# Altium project DriverPCB.PrjPcb
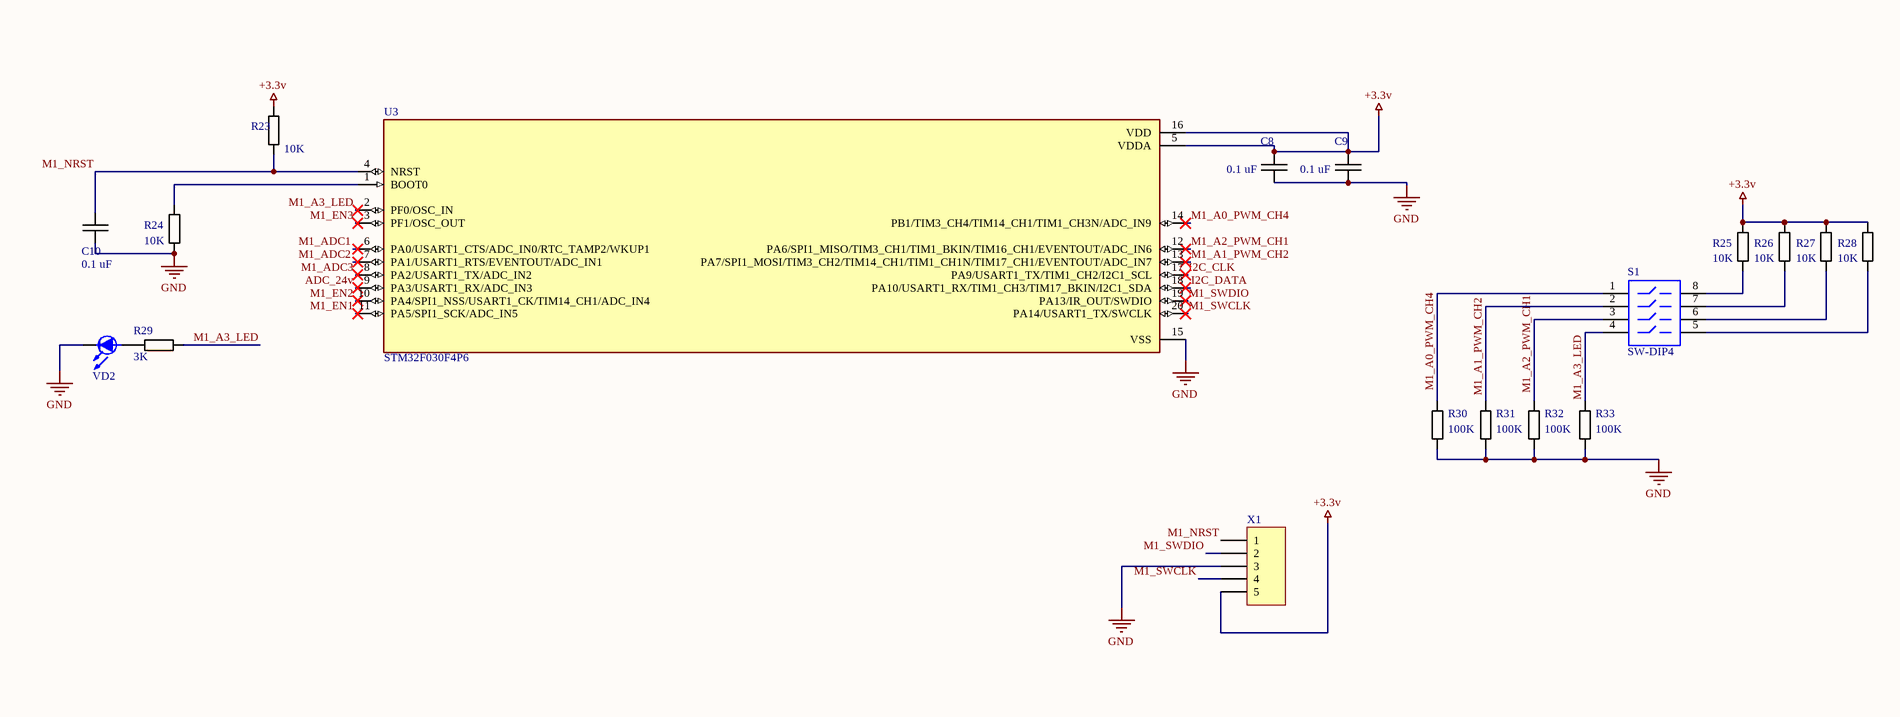
[diagram p0: DriverPCB.SchDoc, top left]
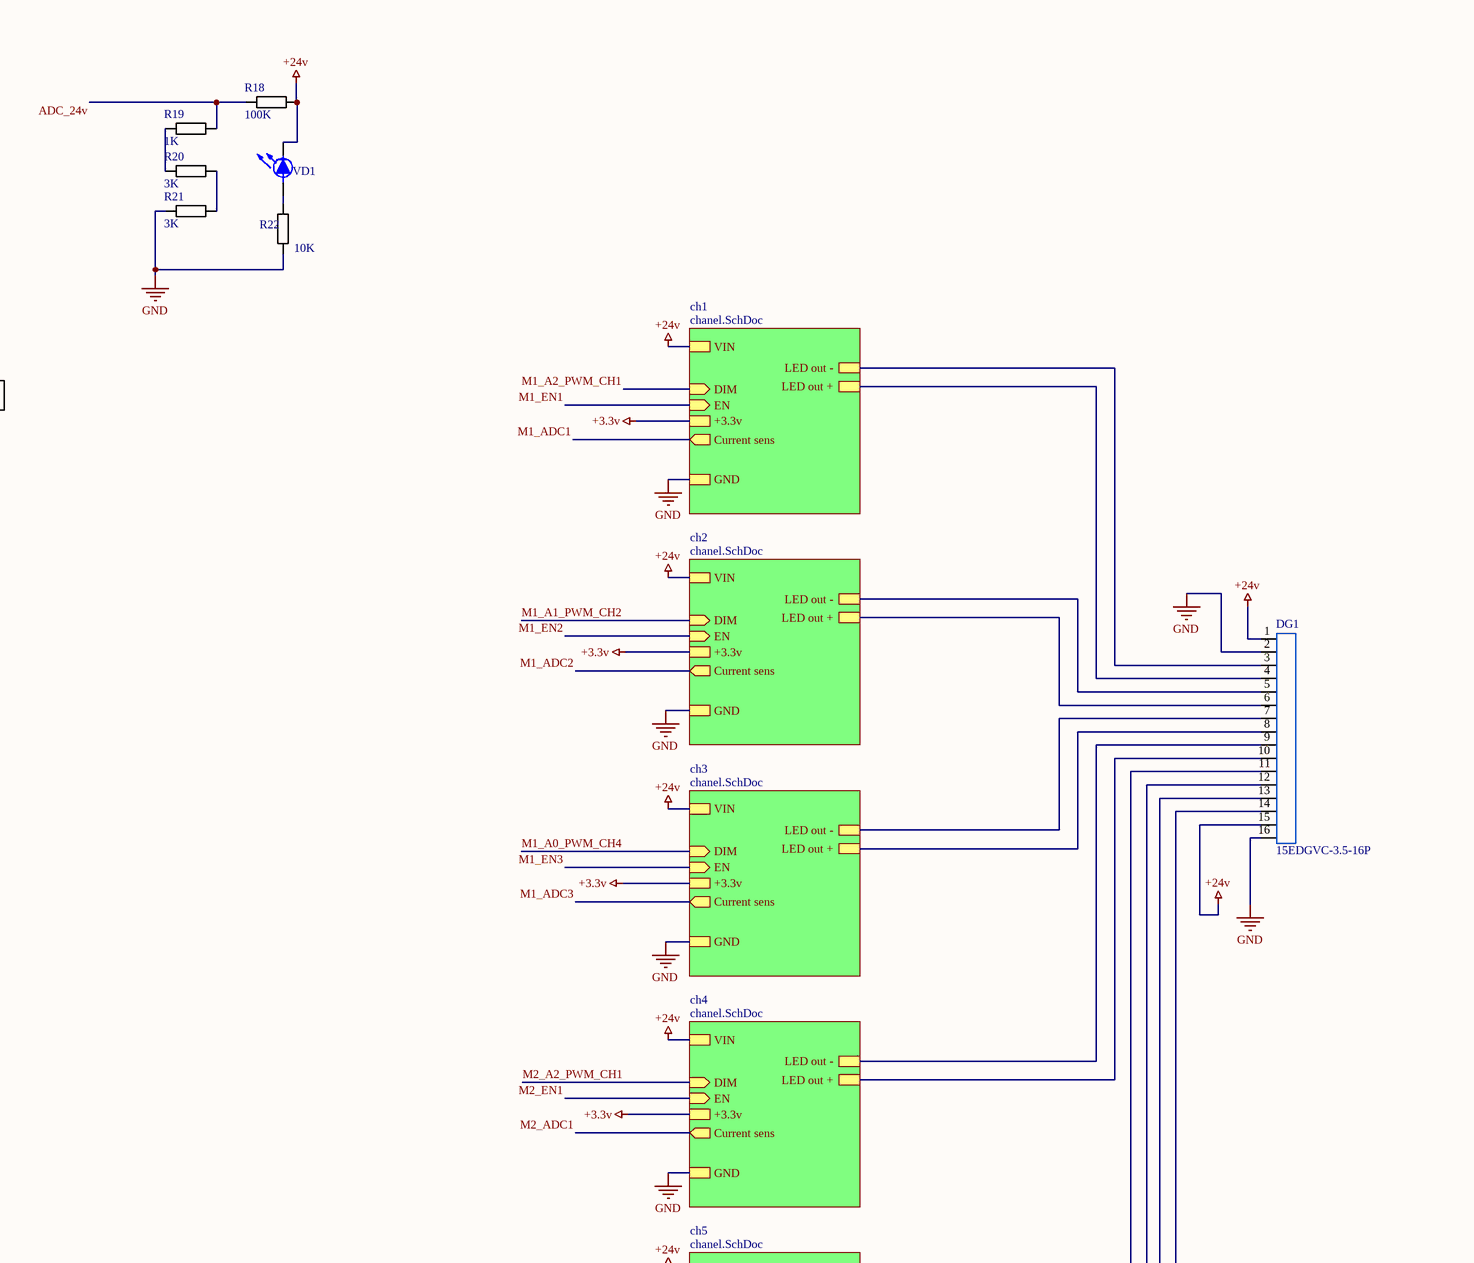
[diagram p1: DriverPCB.SchDoc, top right]
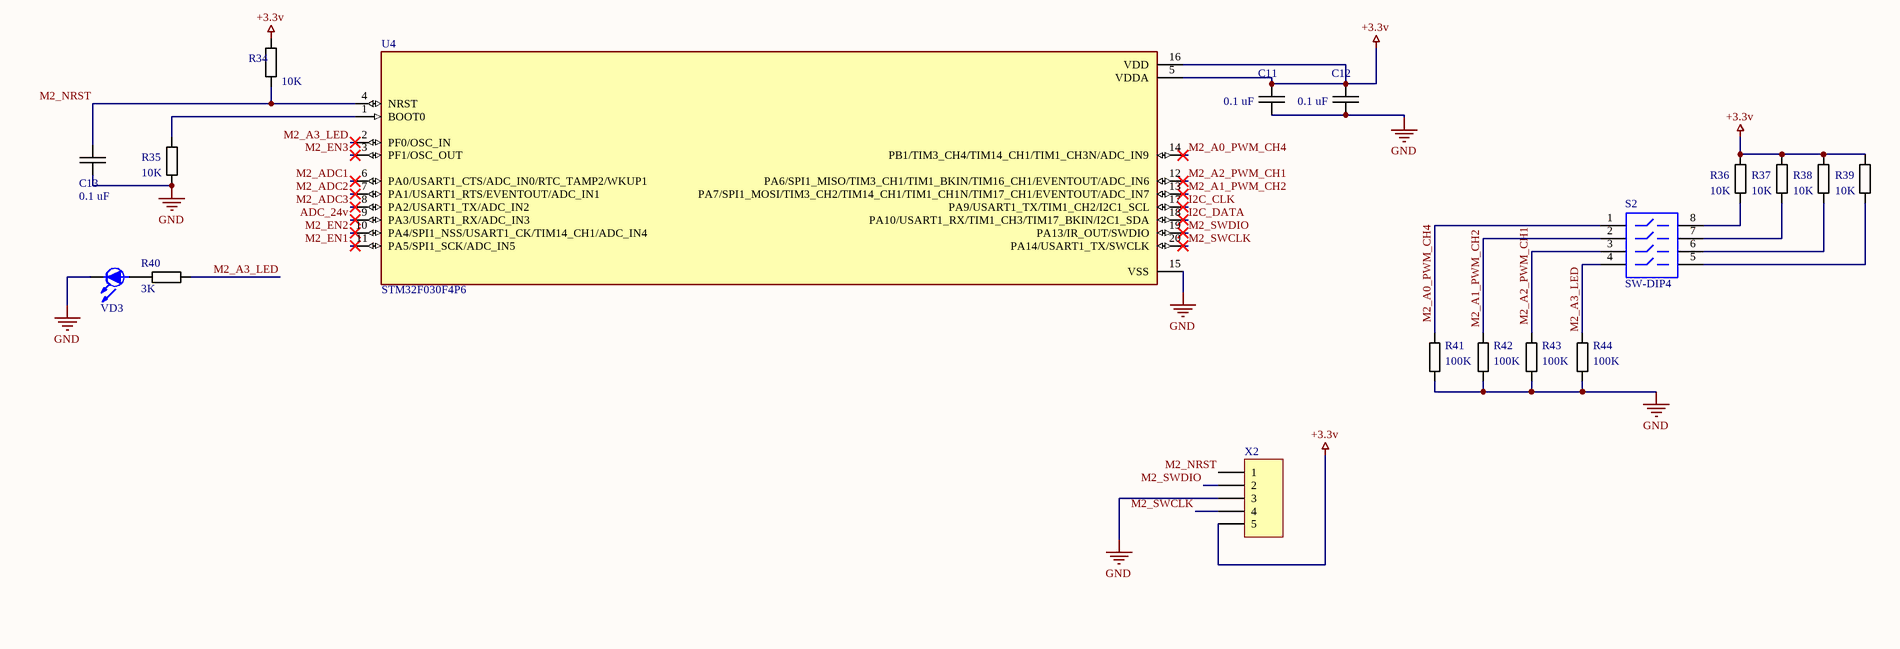
[diagram p2: DriverPCB.SchDoc, bottom left]
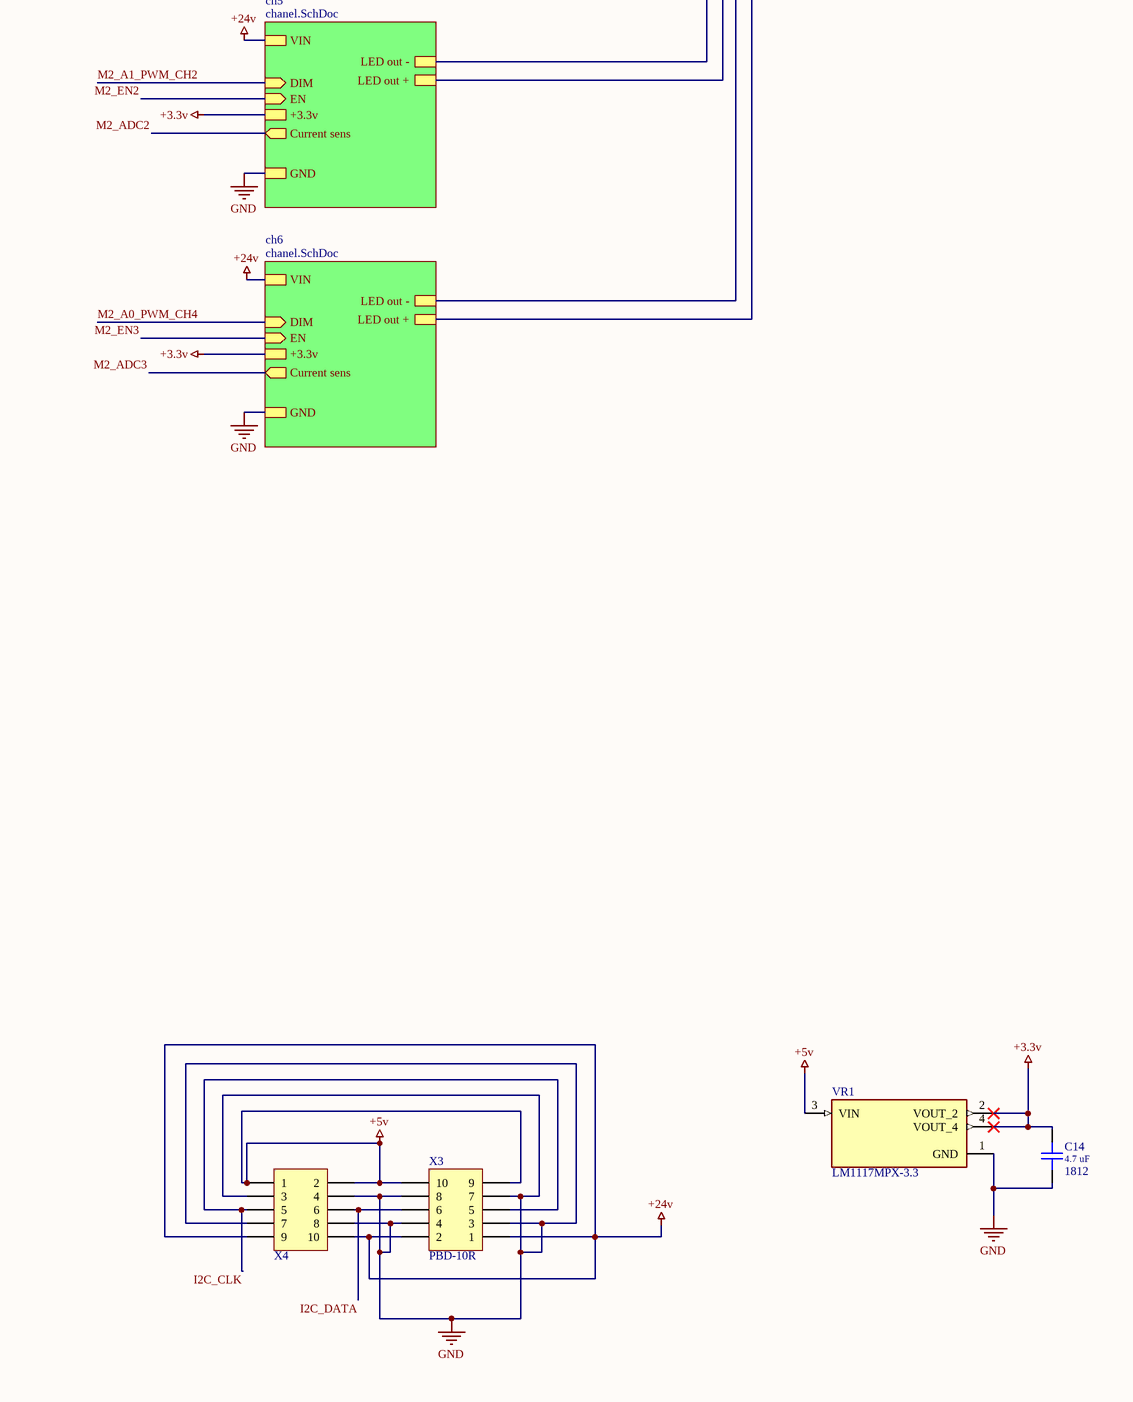
[diagram p3: DriverPCB.SchDoc, bottom right]
2 sheets, 233 parts. Net scope: hierarchical (ports join the sheet entries above them; power ports are global).
Board file: DriverPCB.PcbDoc
Sheets:
  DriverPCB.SchDoc
    ch1 = chanel.SchDoc
    ch2 = chanel.SchDoc
    ch3 = chanel.SchDoc
    ch4 = chanel.SchDoc
    ch5 = chanel.SchDoc
    ch6 = chanel.SchDoc

## Sheet DriverPCB.SchDoc
size A1

### Parts
C8  0.1 uF  [CAPACITOR 0603]
C9  0.1 uF  [CAPACITOR 0603]
C10  0.1 uF  [CAPACITOR 0603]
C11  0.1 uF  [CAPACITOR 0603]
C12  0.1 uF  [CAPACITOR 0603]
C13  0.1 uF  [CAPACITOR 0603]
C14  value 4.7 uF  Package: 1812  [CAPCHIP1812]  (hidden comment: Cap C)
DG1  15EDGVC-3.5-16P  [15EDGVC-3.5-16P]
R18  100K  [Resistor 0402]
R19  1K  [Resistor 0402]
R20  3K  [Resistor 0402]
R21  3K  [Resistor 0402]
R22  10K  [Resistor 0402]
R23  10K  [Resistor 0402]
R24  10K  [Resistor 0402]
R25  10K  [Resistor 0402]
R26  10K  [Resistor 0402]
R27  10K  [Resistor 0402]
R28  10K  [Resistor 0402]
R29  3K  [Resistor 0402]
R30  100K  [Resistor 0402]
R31  100K  [Resistor 0402]
R32  100K  [Resistor 0402]
R33  100K  [Resistor 0402]
R34  10K  [Resistor 0402]
R35  10K  [Resistor 0402]
R36  10K  [Resistor 0402]
R37  10K  [Resistor 0402]
R38  10K  [Resistor 0402]
R39  10K  [Resistor 0402]
R40  3K  [Resistor 0402]
R41  100K  [Resistor 0402]
R42  100K  [Resistor 0402]
R43  100K  [Resistor 0402]
R44  100K  [Resistor 0402]
S1  SW-DIP4  [DIP-8]
S2  SW-DIP4  [DIP-8]
U3  STM32F030F4P6  [SOP65P640X120-20N]
U4  STM32F030F4P6  [SOP65P640X120-20N]
VD1  one color  [0805-]  (value not drawn)
VD2  (no value)  [0805-]
VD3  (no value)  [0805-]
VR1  LM1117MPX-3.3  [VREG_LM1117MPX-3.3]
X1  (no value)  [PLS-5-3D]
X2  (no value)  [PLS-5-3D]
X3  PBD-10R  [PBD-10RR]
X4  PLD-10R  [PLD-10RR1]  (value not drawn)

### Sub-sheets
ch1 = chanel.SchDoc: VIN, GND, LED out +, LED out -, DIM (in), EN (in), +3.3v, Current sens (out)
ch2 = chanel.SchDoc: VIN, GND, LED out +, LED out -, DIM (in), EN (in), +3.3v, Current sens (out)
ch3 = chanel.SchDoc: VIN, GND, LED out +, LED out -, DIM (in), EN (in), +3.3v, Current sens (out)
ch4 = chanel.SchDoc: VIN, GND, LED out +, LED out -, DIM (in), EN (in), +3.3v, Current sens (out)
ch5 = chanel.SchDoc: VIN, GND, LED out +, LED out -, DIM (in), EN (in), +3.3v, Current sens (out)
ch6 = chanel.SchDoc: VIN, GND, LED out +, LED out -, DIM (in), EN (in), +3.3v, Current sens (out)

### Nets
+3.3v: C8.1 C9.1 C11.1 C12.1 C14.2 R23.2 R25.1 R26.1 R27.1 R28.1 R34.2 R36.1 R37.1 R38.1 R39.1 U3.5(VDDA) U3.16(VDD) U4.5(VDDA) U4.16(VDD) VR1.2(VOUT_2) VR1.4(VOUT_4) X1.5 X2.5 ; sheet ch1/+3.3v, sheet ch2/+3.3v, sheet ch3/+3.3v, sheet ch4/+3.3v, sheet ch5/+3.3v, sheet ch6/+3.3v
+5v: VR1.3(VIN) X3.9 X3.10 X4.1 X4.2
+24v: DG1.1 DG1.15 R18.1 VD1.K(k) X3.1 X3.2 X4.9 X4.10 ; sheet ch1/VIN, sheet ch2/VIN, sheet ch3/VIN, sheet ch4/VIN, sheet ch5/VIN, sheet ch6/VIN
GND: C8.2 C9.2 C10.1 C11.2 C12.2 C13.1 C14.1 DG1.2 DG1.16 R21.1 R22.1 R24.2 R30.2 R31.2 R32.2 R33.2 R35.2 R41.2 R42.2 R43.2 R44.2 U3.15(VSS) U4.15(VSS) VD2.K(k) VD3.K(k) VR1.1(GND) X1.3 X2.3 X3.3 X3.4 X3.7 X3.8 X4.3 X4.4 X4.7 X4.8 ; sheet ch1/GND, sheet ch2/GND, sheet ch3/GND, sheet ch4/GND, sheet ch5/GND, sheet ch6/GND
ADC_24v: R18.2 R19.2 U3.9(PA3/USART1_RX/ADC_IN3) U4.9(PA3/USART1_RX/ADC_IN3)
I2C_CLK: U3.17(PA9/USART1_TX/TIM1_CH2/I2C1_SCL) U4.17(PA9/USART1_TX/TIM1_CH2/I2C1_SCL) X3.5 X4.5
I2C_DATA: U3.18(PA10/USART1_RX/TIM1_CH3/TIM17_BKIN/I2C1_SDA) U4.18(PA10/USART1_RX/TIM1_CH3/TIM17_BKIN/I2C1_SDA) X3.6 X4.6
M1_A0_PWM_CH4: R30.1 S1.1 U3.14(PB1/TIM3_CH4/TIM14_CH1/TIM1_CH3N/ADC_IN9) ; sheet ch3/DIM
M1_A1_PWM_CH2: R31.1 S1.2 U3.13(PA7/SPI1_MOSI/TIM3_CH2/TIM14_CH1/TIM1_CH1N/TIM17_CH1/EVENTOUT/ADC_IN7) ; sheet ch2/DIM
M1_A2_PWM_CH1: R32.1 S1.3 U3.12(PA6/SPI1_MISO/TIM3_CH1/TIM1_BKIN/TIM16_CH1/EVENTOUT/ADC_IN6) ; sheet ch1/DIM
M1_A3_LED: R29.1 R33.1 S1.4 U3.2(PF0/OSC_IN)
M1_ADC1: U3.6(PA0/USART1_CTS/ADC_IN0/RTC_TAMP2/WKUP1) ; sheet ch1/Current sens
M1_ADC2: U3.7(PA1/USART1_RTS/EVENTOUT/ADC_IN1) ; sheet ch2/Current sens
M1_ADC3: U3.8(PA2/USART1_TX/ADC_IN2) ; sheet ch3/Current sens
M1_EN1: U3.11(PA5/SPI1_SCK/ADC_IN5) ; sheet ch1/EN
M1_EN2: U3.10(PA4/SPI1_NSS/USART1_CK/TIM14_CH1/ADC_IN4) ; sheet ch2/EN
M1_EN3: U3.3(PF1/OSC_OUT) ; sheet ch3/EN
M1_NRST: C10.2 R23.1 U3.4(NRST) X1.1
M1_SWCLK: U3.20(PA14/USART1_TX/SWCLK) X1.4
M1_SWDIO: U3.19(PA13/IR_OUT/SWDIO) X1.2
M2_A0_PWM_CH4: R41.1 S2.1 U4.14(PB1/TIM3_CH4/TIM14_CH1/TIM1_CH3N/ADC_IN9) ; sheet ch6/DIM
M2_A1_PWM_CH2: R42.1 S2.2 U4.13(PA7/SPI1_MOSI/TIM3_CH2/TIM14_CH1/TIM1_CH1N/TIM17_CH1/EVENTOUT/ADC_IN7) ; sheet ch5/DIM
M2_A2_PWM_CH1: R43.1 S2.3 U4.12(PA6/SPI1_MISO/TIM3_CH1/TIM1_BKIN/TIM16_CH1/EVENTOUT/ADC_IN6) ; sheet ch4/DIM
M2_A3_LED: R40.1 R44.1 S2.4 U4.2(PF0/OSC_IN)
M2_ADC1: U4.6(PA0/USART1_CTS/ADC_IN0/RTC_TAMP2/WKUP1) ; sheet ch4/Current sens
M2_ADC2: U4.7(PA1/USART1_RTS/EVENTOUT/ADC_IN1) ; sheet ch5/Current sens
M2_ADC3: U4.8(PA2/USART1_TX/ADC_IN2) ; sheet ch6/Current sens
M2_EN1: U4.11(PA5/SPI1_SCK/ADC_IN5) ; sheet ch4/EN
M2_EN2: U4.10(PA4/SPI1_NSS/USART1_CK/TIM14_CH1/ADC_IN4) ; sheet ch5/EN
M2_EN3: U4.3(PF1/OSC_OUT) ; sheet ch6/EN
M2_NRST: C13.2 R34.1 U4.4(NRST) X2.1
M2_SWCLK: U4.20(PA14/USART1_TX/SWCLK) X2.4
M2_SWDIO: U4.19(PA13/IR_OUT/SWDIO) X2.2
NetC5_ch1_1: DG1.3 ; sheet ch1/LED out -
NetC5_ch1_2: DG1.4 ; sheet ch1/LED out +
NetC5_ch2_1: DG1.5 ; sheet ch2/LED out -
NetC5_ch2_2: DG1.6 ; sheet ch2/LED out +
NetC5_ch3_1: DG1.7 ; sheet ch3/LED out -
NetC5_ch3_2: DG1.8 ; sheet ch3/LED out +
NetC5_ch4_1: DG1.9 ; sheet ch4/LED out -
NetC5_ch4_2: DG1.10 ; sheet ch4/LED out +
NetC5_ch5_1: DG1.11 ; sheet ch5/LED out -
NetC5_ch5_2: DG1.12 ; sheet ch5/LED out +
NetC5_ch6_1: DG1.13 ; sheet ch6/LED out -
NetC5_ch6_2: DG1.14 ; sheet ch6/LED out +
NetR19_1: R19.1 R20.1
NetR20_2: R20.2 R21.2
NetR22_2: R22.2 VD1.A(a)
NetR24_1: R24.1 U3.1(BOOT0)
NetR25_2: R25.2 S1.8
NetR26_2: R26.2 S1.7
NetR27_2: R27.2 S1.6
NetR28_2: R28.2 S1.5
NetR29_2: R29.2 VD2.A(a)
NetR35_1: R35.1 U4.1(BOOT0)
NetR36_2: R36.2 S2.8
NetR37_2: R37.2 S2.7
NetR38_2: R38.2 S2.6
NetR39_2: R39.2 S2.5
NetR40_2: R40.2 VD3.A(a)

### Library data of the parts
C8-C13 = Capasitor: Value: 0.1 uF; Package: 0603
C14 = Cap C: Ceramic Capacitor; Class: Электронные компоненты; SubClass: Конденсаторы; TKE: {TKE}; Ordering_Information: {Ordering_Information}; Installation: {Installation}; Body: {Body}; Nominal_voltage_V: {Nominal_voltage_V}; Tolerance_Percent: {Tolerance_Percent}; Pins: {Pins}
R18-R44 = Resistor: Package: 0402
  R18 R30-R33 R41-R44: Value: 100K
  R19: Value: 1K
  R20 R21 R29 R40: Value: 3K
  R22-R28 R34-R39: Value: 10K
S1 S2 = SW-DIP4: DIP Switch; Published: 24-Mar-1999; LatestRevisionDate: 17-Jul-2002; LatestRevisionNote: Re-released for DXP Platform.; PackageReference: DIP-8; Publisher: Altium Limited
U3 U4 = STM32F030F4P6: MCU 32-bit STM32F ARM Cortex M0 RISC 16KB Flash 2.5V/3.3V 20-Pin TSSOP Tray; Value: *; Availability: Unavailable; Price: None; MP: STM32F030F4P6; Package: None
VD1 = LED SMD: Class: Электронные компоненты; SubClass: Светодиоды; Value: {Value}; Pitch_mm: {Pitch_mm}; Ordering_Information: {Ordering_Information}; Luminous_intensity_mcd: {Luminous_intensity_mcd}; Diameter_mm: {Diameter_mm}; Color: {Color}; Installation: {Installation}; Body: {Body}; Pins: 2
VD2 VD3 = LED SMD: Value: 0805; CompType: LED; Note: Read; Pins: 2; Package: 0805
VR1 = LM1117MPX-3.3: 800-mA 15-V linear voltage regulator; MF: Texas Instruments; Check_prices: https://www.snapeda.com/parts/LM1117MPX-3.3/Texas+Instruments/view-part/?ref=eda; Value: *; Availability: In Stock; MP: LM1117MPX-3.3; Price: None; Package: SOT-223-4 Texas Instruments; SnapEDA_Link: https://www.snapeda.com/parts/LM1117MPX-3.3/Texas+Instruments/view-part/?ref=snap; Purchase-URL: https://pricing.snapeda.com/search/part/LM1117MPX-3.3/?ref=eda
X1 X2 = PLS-5: Header, 5-Pin; CompType: connector; Note: header pins 2.54mm x 5; Package: 2.54 x 5; PartNumber: PLS-5; Pins: 5
X3 = PBD-10R: Header, 5-Pin, Dual row
X4 = PLD-10R: Header, 5-Pin, Dual row

## Sheet chanel.SchDoc
size A2
Used 6 times, as channels ch1, ch2, ch3, ch4, ch5, ch6. Parts and nets are listed once, with the designators drawn on the sheet.
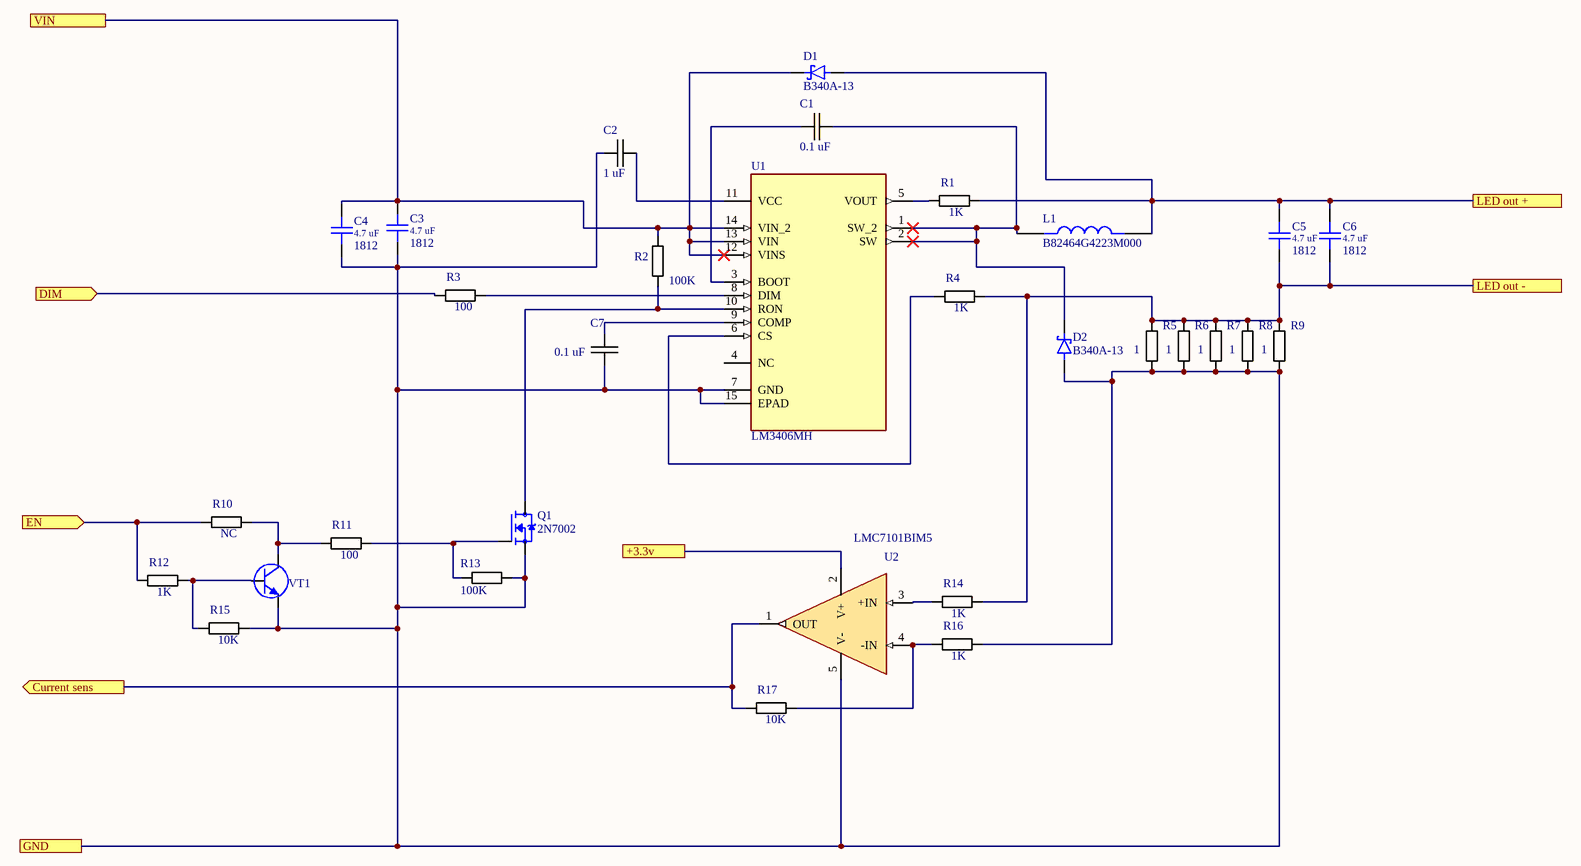
[diagram p4: chanel.SchDoc]

### Parts
C1  0.1 uF  [CAPACITOR 0603]
C2  1 uF  [CAPACITOR 0603]
C3  value 4.7 uF  Package: 1812  [CAPCHIP1812]  (hidden comment: Cap C)
C4  value 4.7 uF  Package: 1812  [CAPCHIP1812]  (hidden comment: Cap C)
C5  value 4.7 uF  Package: 1812  [CAPCHIP1812]  (hidden comment: Cap C)
C6  value 4.7 uF  Package: 1812  [CAPCHIP1812]  (hidden comment: Cap C)
C7  0.1 uF  [CAPACITOR 0603]
D1  B340A-13  [DIOM5226X240N]
D2  B340A-13  [DIOM5226X240N]
L1  B82464G4223M000  [IND_B82464G4223M000]
Q1  2N7002  [SOT95P240X111-3N]
R1  1K  [Resistor 0402]
R2  100K  [Resistor 0402]
R3  100  [Resistor 0402]
R4  1K  [Resistor 0402]
R5  1  [Resistor 1206]
R6  1  [Resistor 1206]
R7  1  [Resistor 1206]
R8  1  [Resistor 1206]
R9  1  [Resistor 1206]
R10  NC  [Resistor 0402]
R11  100  [Resistor 0402]
R12  1K  [Resistor 0402]
R13  100K  [Resistor 0402]
R14  1K  [Resistor 0402]
R15  10K  [Resistor 0402]
R16  1K  [Resistor 0402]
R17  10K  [Resistor 0402]
U1  LM3406MH  [SOP65P640X110-15N]
U2  LMC7101BIM5  [*SOT95P280X145-5N]
VT1  NPN BEC  [SOT23]  (value not drawn)

### Ports
+3.3v, Current sens (out), DIM (in), EN (in), GND, LED out +, LED out -, VIN

### Nets
+3.3v: U2.2(V+) ; port +3.3v
Current sens: R17.2 U2.1(OUT) ; port Current sens
DIM: R3.2 ; port DIM
EN: R10.2 R12.2 ; port EN
GND: C2.2 C3.1 C4.1 C7.2 D2.A Q1.2(S) R5.2 R6.2 R7.2 R8.2 R9.2 R13.1 R15.1 R16.1 U1.7(GND) U1.15(EPAD) U2.5(V-) VT1.2(E) ; port GND
LED out +: C5.2 C6.2 D1.A L1.2 R1.1 ; port LED out +
LED out -: C5.1 C6.1 R4.1 R5.1 R6.1 R7.1 R8.1 R9.1 R14.1 ; port LED out -
VIN: C3.2 C4.2 D1.C R2.2 U1.12(VINS) U1.13(VIN) U1.14(VIN_2) ; port VIN
NetC1_1: C1.1 D2.C L1.1 U1.1(SW_2) U1.2(SW)
NetC1_2: C1.2 U1.3(BOOT)
NetC2_1: C2.1 U1.11(VCC)
NetC7_1: C7.1 U1.9(COMP)
NetQ1_1: Q1.1(G) R11.1 R13.2
NetQ1_3: Q1.3(D) R2.1 U1.10(RON)
NetR1_2: R1.2 U1.5(VOUT)
NetR3_1: R3.1 U1.8(DIM)
NetR4_2: R4.2 U1.6(CS)
NetR10_1: R10.1 R11.2 VT1.3(C)
NetR12_1: R12.1 R15.2 VT1.1(B)
NetR14_2: R14.2 U2.3(+IN)
NetR16_2: R16.2 R17.1 U2.4(-IN)

Not connected (* = marked no-connect by the designer): U1 4(NC)

### Channels
ch1: designators end in _ch1; ports +3.3v=+3.3v Current sens=M1_ADC1 DIM=M1_A2_PWM_CH1 EN=M1_EN1 GND=GND LED out +=NetC5_ch1_2 LED out -=NetC5_ch1_1 VIN=+24v
ch2: designators end in _ch2; ports +3.3v=+3.3v Current sens=M1_ADC2 DIM=M1_A1_PWM_CH2 EN=M1_EN2 GND=GND LED out +=NetC5_ch2_2 LED out -=NetC5_ch2_1 VIN=+24v
ch3: designators end in _ch3; ports +3.3v=+3.3v Current sens=M1_ADC3 DIM=M1_A0_PWM_CH4 EN=M1_EN3 GND=GND LED out +=NetC5_ch3_2 LED out -=NetC5_ch3_1 VIN=+24v
ch4: designators end in _ch4; ports +3.3v=+3.3v Current sens=M2_ADC1 DIM=M2_A2_PWM_CH1 EN=M2_EN1 GND=GND LED out +=NetC5_ch4_2 LED out -=NetC5_ch4_1 VIN=+24v
ch5: designators end in _ch5; ports +3.3v=+3.3v Current sens=M2_ADC2 DIM=M2_A1_PWM_CH2 EN=M2_EN2 GND=GND LED out +=NetC5_ch5_2 LED out -=NetC5_ch5_1 VIN=+24v
ch6: designators end in _ch6; ports +3.3v=+3.3v Current sens=M2_ADC3 DIM=M2_A0_PWM_CH4 EN=M2_EN3 GND=GND LED out +=NetC5_ch6_2 LED out -=NetC5_ch6_1 VIN=+24v

### Library data of the parts
C1 C2 C7 = Capasitor: Package: 0603
  C1 C7: Value: 0.1 uF
  C2: Value: 1 uF
C3-C6 = Cap C: as C14 on sheet DriverPCB; Pins: {Pins}
D1 D2 = B340A-13: Diode Schottky 40 V 3A Surface Mount SMA; MF: Diodes Inc.; Value: *; MP: B340A-13; Package: DO-214 Diodes Inc.; Availability: In Stock; Price: None; SnapEDA_Link: https://www.snapeda.com/parts/B340A-13/Diodes+Inc./view-part/?ref=snap; Check_prices: https://www.snapeda.com/parts/B340A-13/Diodes+Inc./view-part/?ref=eda; Purchase-URL: https://pricing.snapeda.com/search/part/B340A-13/?ref=eda
L1 = B82464G4223M000: MF: TDK ELECTRONICS; Check_prices: https://www.snapeda.com/parts/B82464G4223M000/TM+Electronics/view-part/?ref=eda; Package: None; Value: *; MP: B82464G4223M000; SnapEDA_Link: https://www.snapeda.com/parts/B82464G4223M000/TM+Electronics/view-part/?ref=snap; Purchase-URL: https://pricing.snapeda.com/search/part/B82464G4223M000/?ref=eda
Q1 = 2N7002: N-Channel 60V 280mA (Ta) 350mW (Ta) Surface Mount SOT-23-3 (TO-236); MP: altium_native_batch; Package: None; Price: None; Availability: Unavailable; Value: *
R1-R17 = Resistor
  R1 R4 R12 R14 R16: Value: 1K; Package: 0402
  R2 R13: Value: 100K; Package: 0402
  R3 R11: Value: 100; Package: 0402
  R5-R9: Value: 1; Package: 1206
  R10: Value: NC; Package: 0402
  R15 R17: Value: 10K; Package: 0402
U1 = LM3406MH: Constant Current Buck Regulator; Package: None; Price: None; Value: *; MP: LM3406MH; Availability: Unavailable
VT1 = BC846: NPN Bipolar Transistor; Published: 17.04.2012; Publisher: Reukov A.V.
U2 = LMC7101BIM5: Check_prices: https://www.snapeda.com/parts/LMC7101BIM5/Texas%20Instruments/view-part/19255/?ref=eda; SnapEDA_Link: https://www.snapeda.com/parts/LMC7101BIM5/Texas%20Instruments/view-part/19255/?ref=snap; Value: *

## Nets that join several sheets
+3.3v: DriverPCB (23 pins), ch1 (U2_ch1.2), ch2 (U2_ch2.2), ch3 (U2_ch3.2), ch4 (U2_ch4.2), ch5 (U2_ch5.2), ch6 (U2_ch6.2)
+24v: DriverPCB (8 pins), ch1 (7 pins), ch2 (7 pins), ch3 (7 pins), ch4 (7 pins), ch5 (7 pins), ch6 (7 pins)
GND: DriverPCB (36 pins), ch1 (18 pins), ch2 (18 pins), ch3 (18 pins), ch4 (18 pins), ch5 (18 pins), ch6 (18 pins)
M1_A0_PWM_CH4: DriverPCB (R30.1 S1.1 U3.14), ch3 (R3_ch3.2)
M1_A1_PWM_CH2: DriverPCB (R31.1 S1.2 U3.13), ch2 (R3_ch2.2)
M1_A2_PWM_CH1: DriverPCB (R32.1 S1.3 U3.12), ch1 (R3_ch1.2)
M1_ADC1: DriverPCB (U3.6), ch1 (R17_ch1.2 U2_ch1.1)
M1_ADC2: DriverPCB (U3.7), ch2 (R17_ch2.2 U2_ch2.1)
M1_ADC3: DriverPCB (U3.8), ch3 (R17_ch3.2 U2_ch3.1)
M1_EN1: DriverPCB (U3.11), ch1 (R10_ch1.2 R12_ch1.2)
M1_EN2: DriverPCB (U3.10), ch2 (R10_ch2.2 R12_ch2.2)
M1_EN3: DriverPCB (U3.3), ch3 (R10_ch3.2 R12_ch3.2)
M2_A0_PWM_CH4: DriverPCB (R41.1 S2.1 U4.14), ch6 (R3_ch6.2)
M2_A1_PWM_CH2: DriverPCB (R42.1 S2.2 U4.13), ch5 (R3_ch5.2)
M2_A2_PWM_CH1: DriverPCB (R43.1 S2.3 U4.12), ch4 (R3_ch4.2)
M2_ADC1: DriverPCB (U4.6), ch4 (R17_ch4.2 U2_ch4.1)
M2_ADC2: DriverPCB (U4.7), ch5 (R17_ch5.2 U2_ch5.1)
M2_ADC3: DriverPCB (U4.8), ch6 (R17_ch6.2 U2_ch6.1)
M2_EN1: DriverPCB (U4.11), ch4 (R10_ch4.2 R12_ch4.2)
M2_EN2: DriverPCB (U4.10), ch5 (R10_ch5.2 R12_ch5.2)
M2_EN3: DriverPCB (U4.3), ch6 (R10_ch6.2 R12_ch6.2)
NetC5_ch1_1: DriverPCB (DG1.3), ch1 (9 pins)
NetC5_ch1_2: DriverPCB (DG1.4), ch1 (5 pins)
NetC5_ch2_1: DriverPCB (DG1.5), ch2 (9 pins)
NetC5_ch2_2: DriverPCB (DG1.6), ch2 (5 pins)
NetC5_ch3_1: DriverPCB (DG1.7), ch3 (9 pins)
NetC5_ch3_2: DriverPCB (DG1.8), ch3 (5 pins)
NetC5_ch4_1: DriverPCB (DG1.9), ch4 (9 pins)
NetC5_ch4_2: DriverPCB (DG1.10), ch4 (5 pins)
NetC5_ch5_1: DriverPCB (DG1.11), ch5 (9 pins)
NetC5_ch5_2: DriverPCB (DG1.12), ch5 (5 pins)
NetC5_ch6_1: DriverPCB (DG1.13), ch6 (9 pins)
NetC5_ch6_2: DriverPCB (DG1.14), ch6 (5 pins)